# EAGLE schematic chessbot (EAGLE 9.6.2)
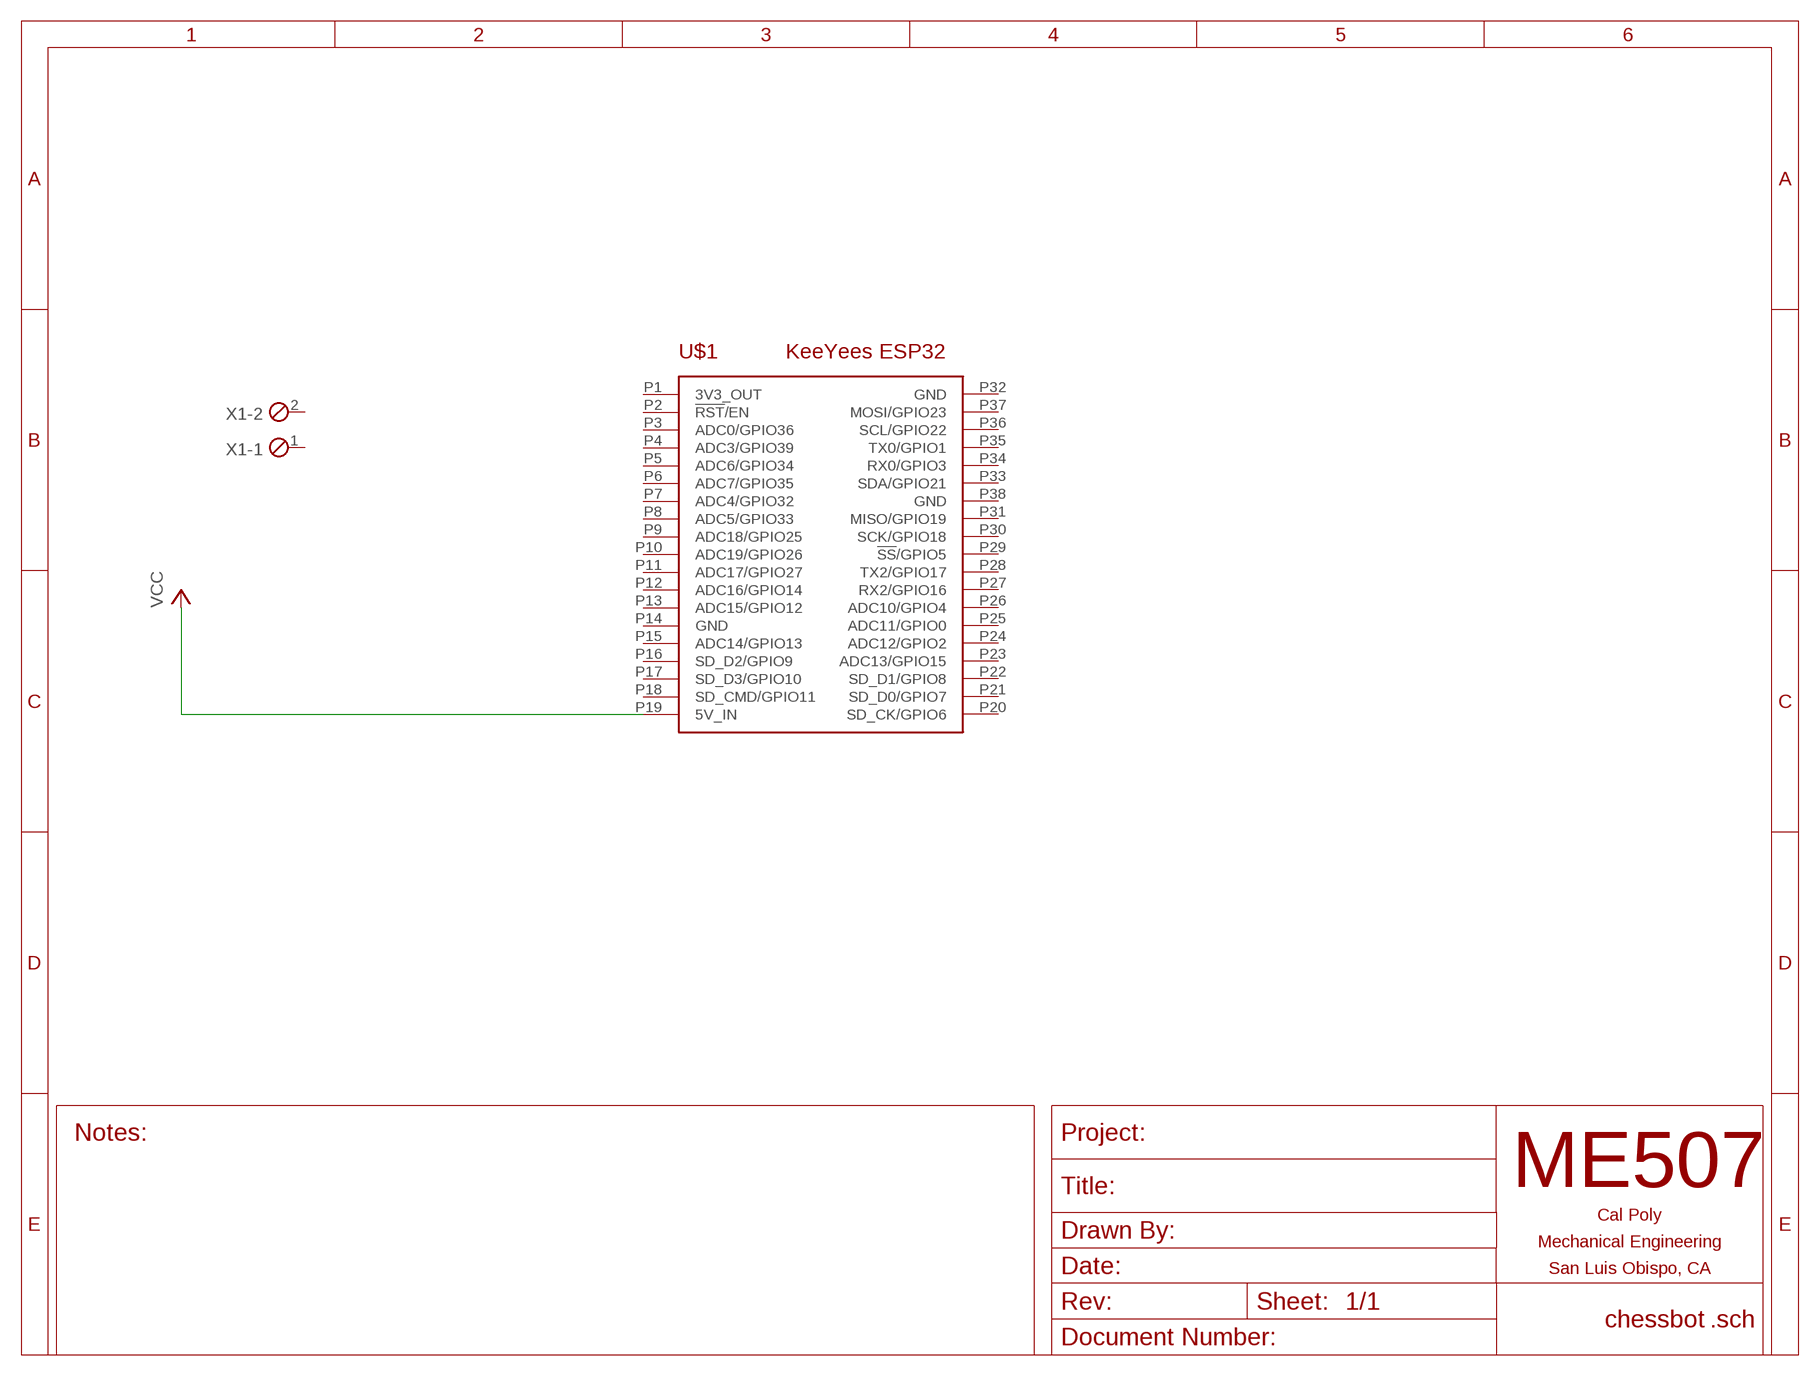
[diagram p0: schematic, sheet 1]

## Parts
U$1  KEEYEES_ESP32  [KEEYEES_ESP32]
X1  SCREWTERM_2P_254  [2POL254]

## Nets
VCC: U$1.P19(5V_IN)
Unconnected: U$1.P2(!RST!/EN) U$1.P3(ADC0/GPIO36) U$1.P4(ADC3/GPIO39) U$1.P5(ADC6/GPIO34) U$1.P6(ADC7/GPIO35) U$1.P7(ADC4/GPIO32) U$1.P8(ADC5/GPIO33) U$1.P9(ADC18/GPIO25) U$1.P10(ADC19/GPIO26) U$1.P11(ADC17/GPIO27) U$1.P12(ADC16/GPIO14) U$1.P13(ADC15/GPIO12) U$1.P15(ADC14/GPIO13) U$1.P16(SD_D2/GPIO9) U$1.P17(SD_D3/GPIO10) U$1.P18(SD_CMD/GPIO11) U$1.P20(SD_CK/GPIO6) U$1.P21(SD_D0/GPIO7) U$1.P22(SD_D1/GPIO8) U$1.P23(ADC13/GPIO15) U$1.P24(ADC12/GPIO2) U$1.P25(ADC11/GPIO0) U$1.P26(ADC10/GPIO4) U$1.P27(RX2/GPIO16) U$1.P28(TX2/GPIO17) U$1.P29(!SS!/GPIO5) U$1.P30(SCK/GPIO18) U$1.P31(MISO/GPIO19) U$1.P33(SDA/GPIO21) U$1.P34(RX0/GPIO3) U$1.P35(TX0/GPIO1) U$1.P36(SCL/GPIO22) U$1.P37(MOSI/GPIO23) X1.1 X1.2

## Power pins joined to a net without a drawn wire
3V3_OUT: U$1.P1(3V3_OUT)
GND: U$1.P14(GND) U$1.P32(GND) U$1.P38(GND)

## Library data of the parts
U$1 = ME507:KEEYEES_ESP32: Footprint for an add-on board (shield, hat, etc.) for a KeeYees ESP32 development board with ESP-WROOM-32 module. 38 pins.
X1 = ME507:SCREWTERM_2P: Screw Terminal Block This part is designed for a screw terminal connector. The 2.54mm (0.100 inch) foorprint can also be used for male or female pin headers such as those on most development boards. One can also solder wires directly into the holes, though this makes modifications or repairs to the system more inconvenient. Larger versions can carry more current.